# EAGLE schematic SDA391V1_TASLAK (EAGLE 9.6.2)
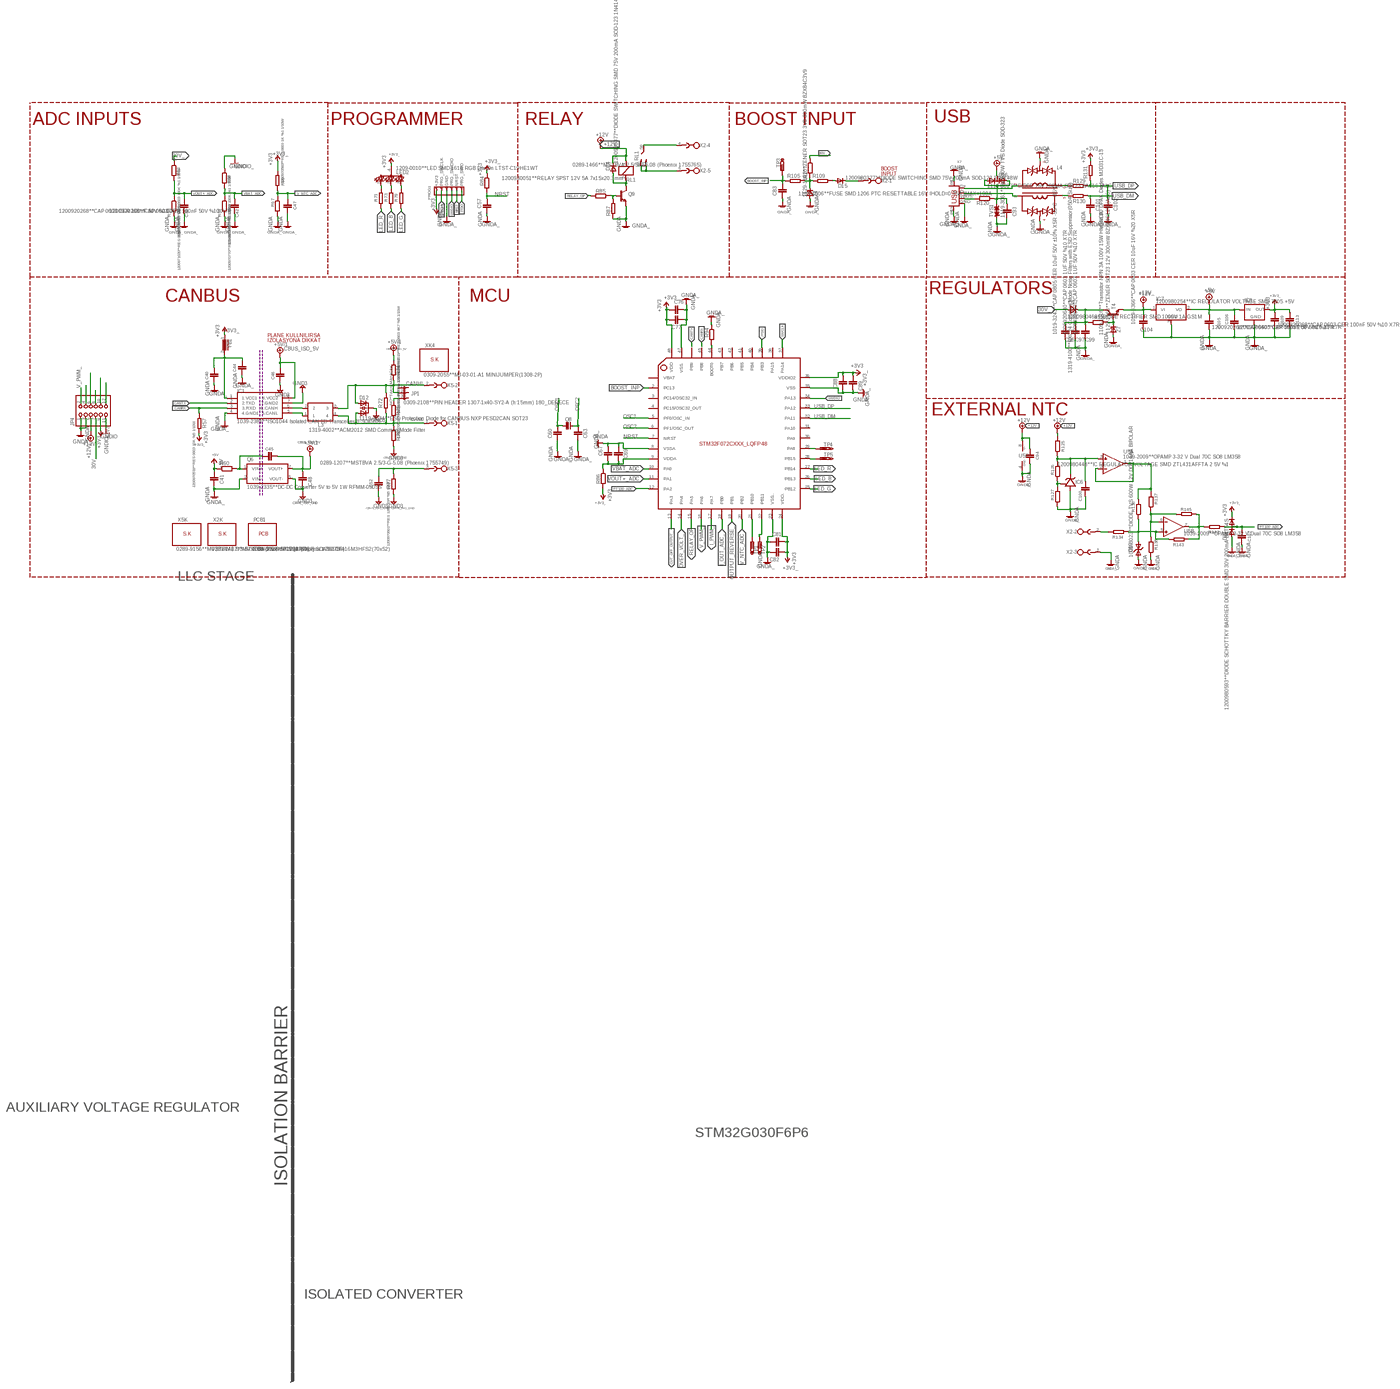
[diagram p0: schematic, sheet 1, overview]
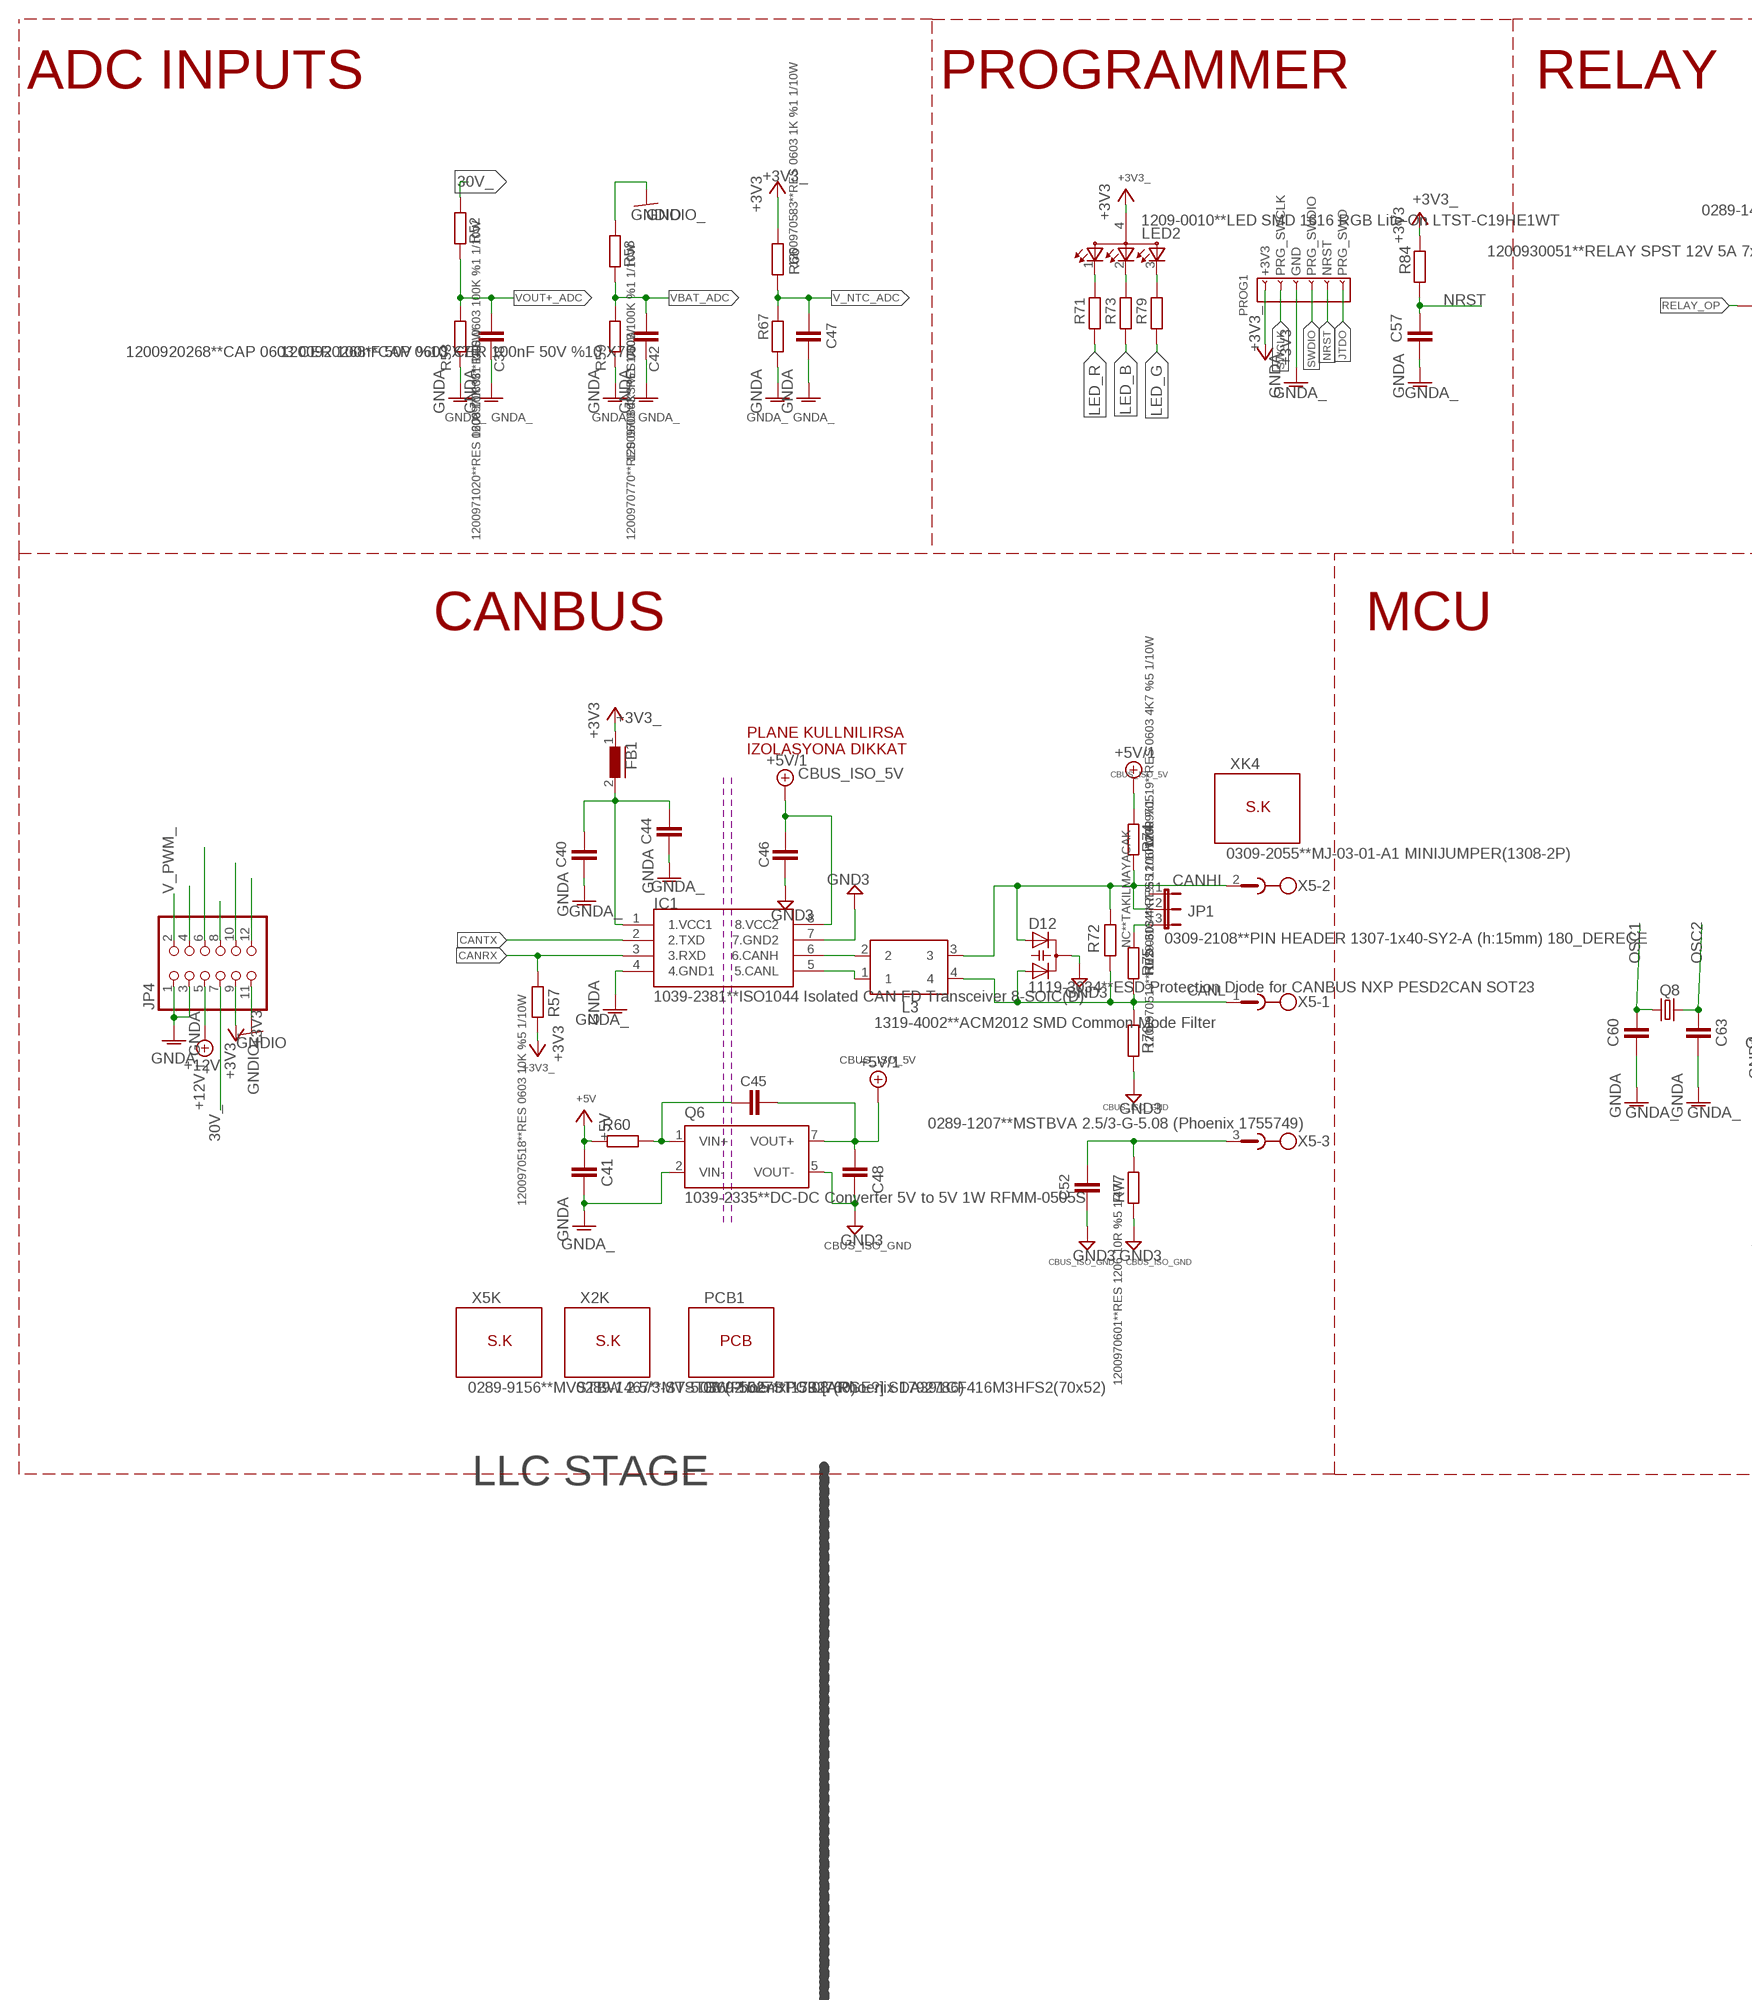
[diagram p1: schematic, sheet 1, part 1 of 4]
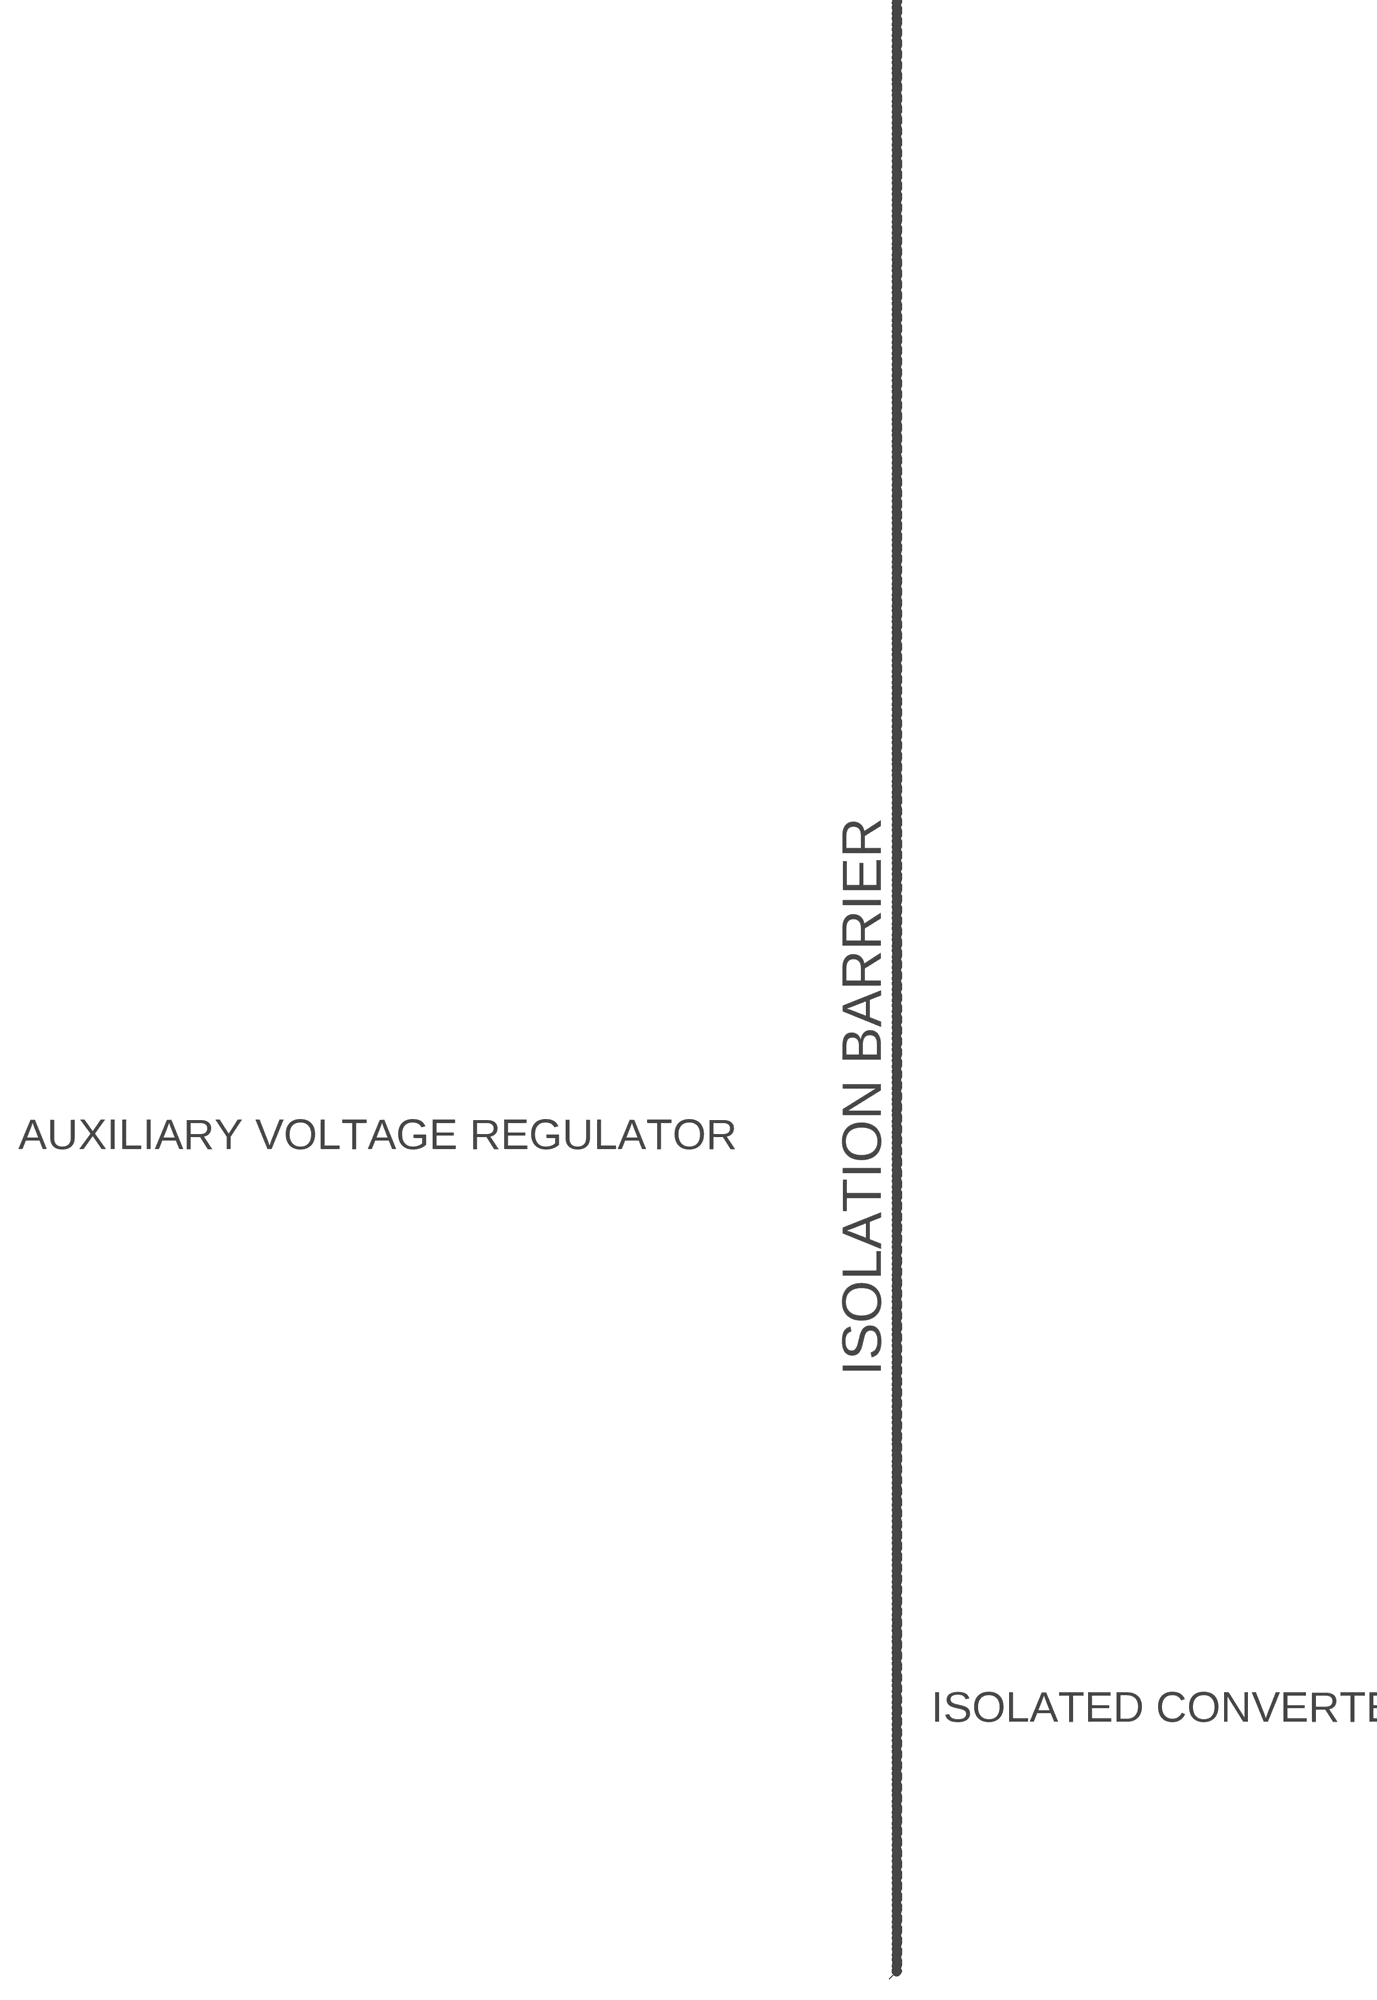
[diagram p2: schematic, sheet 1, part 2 of 4]
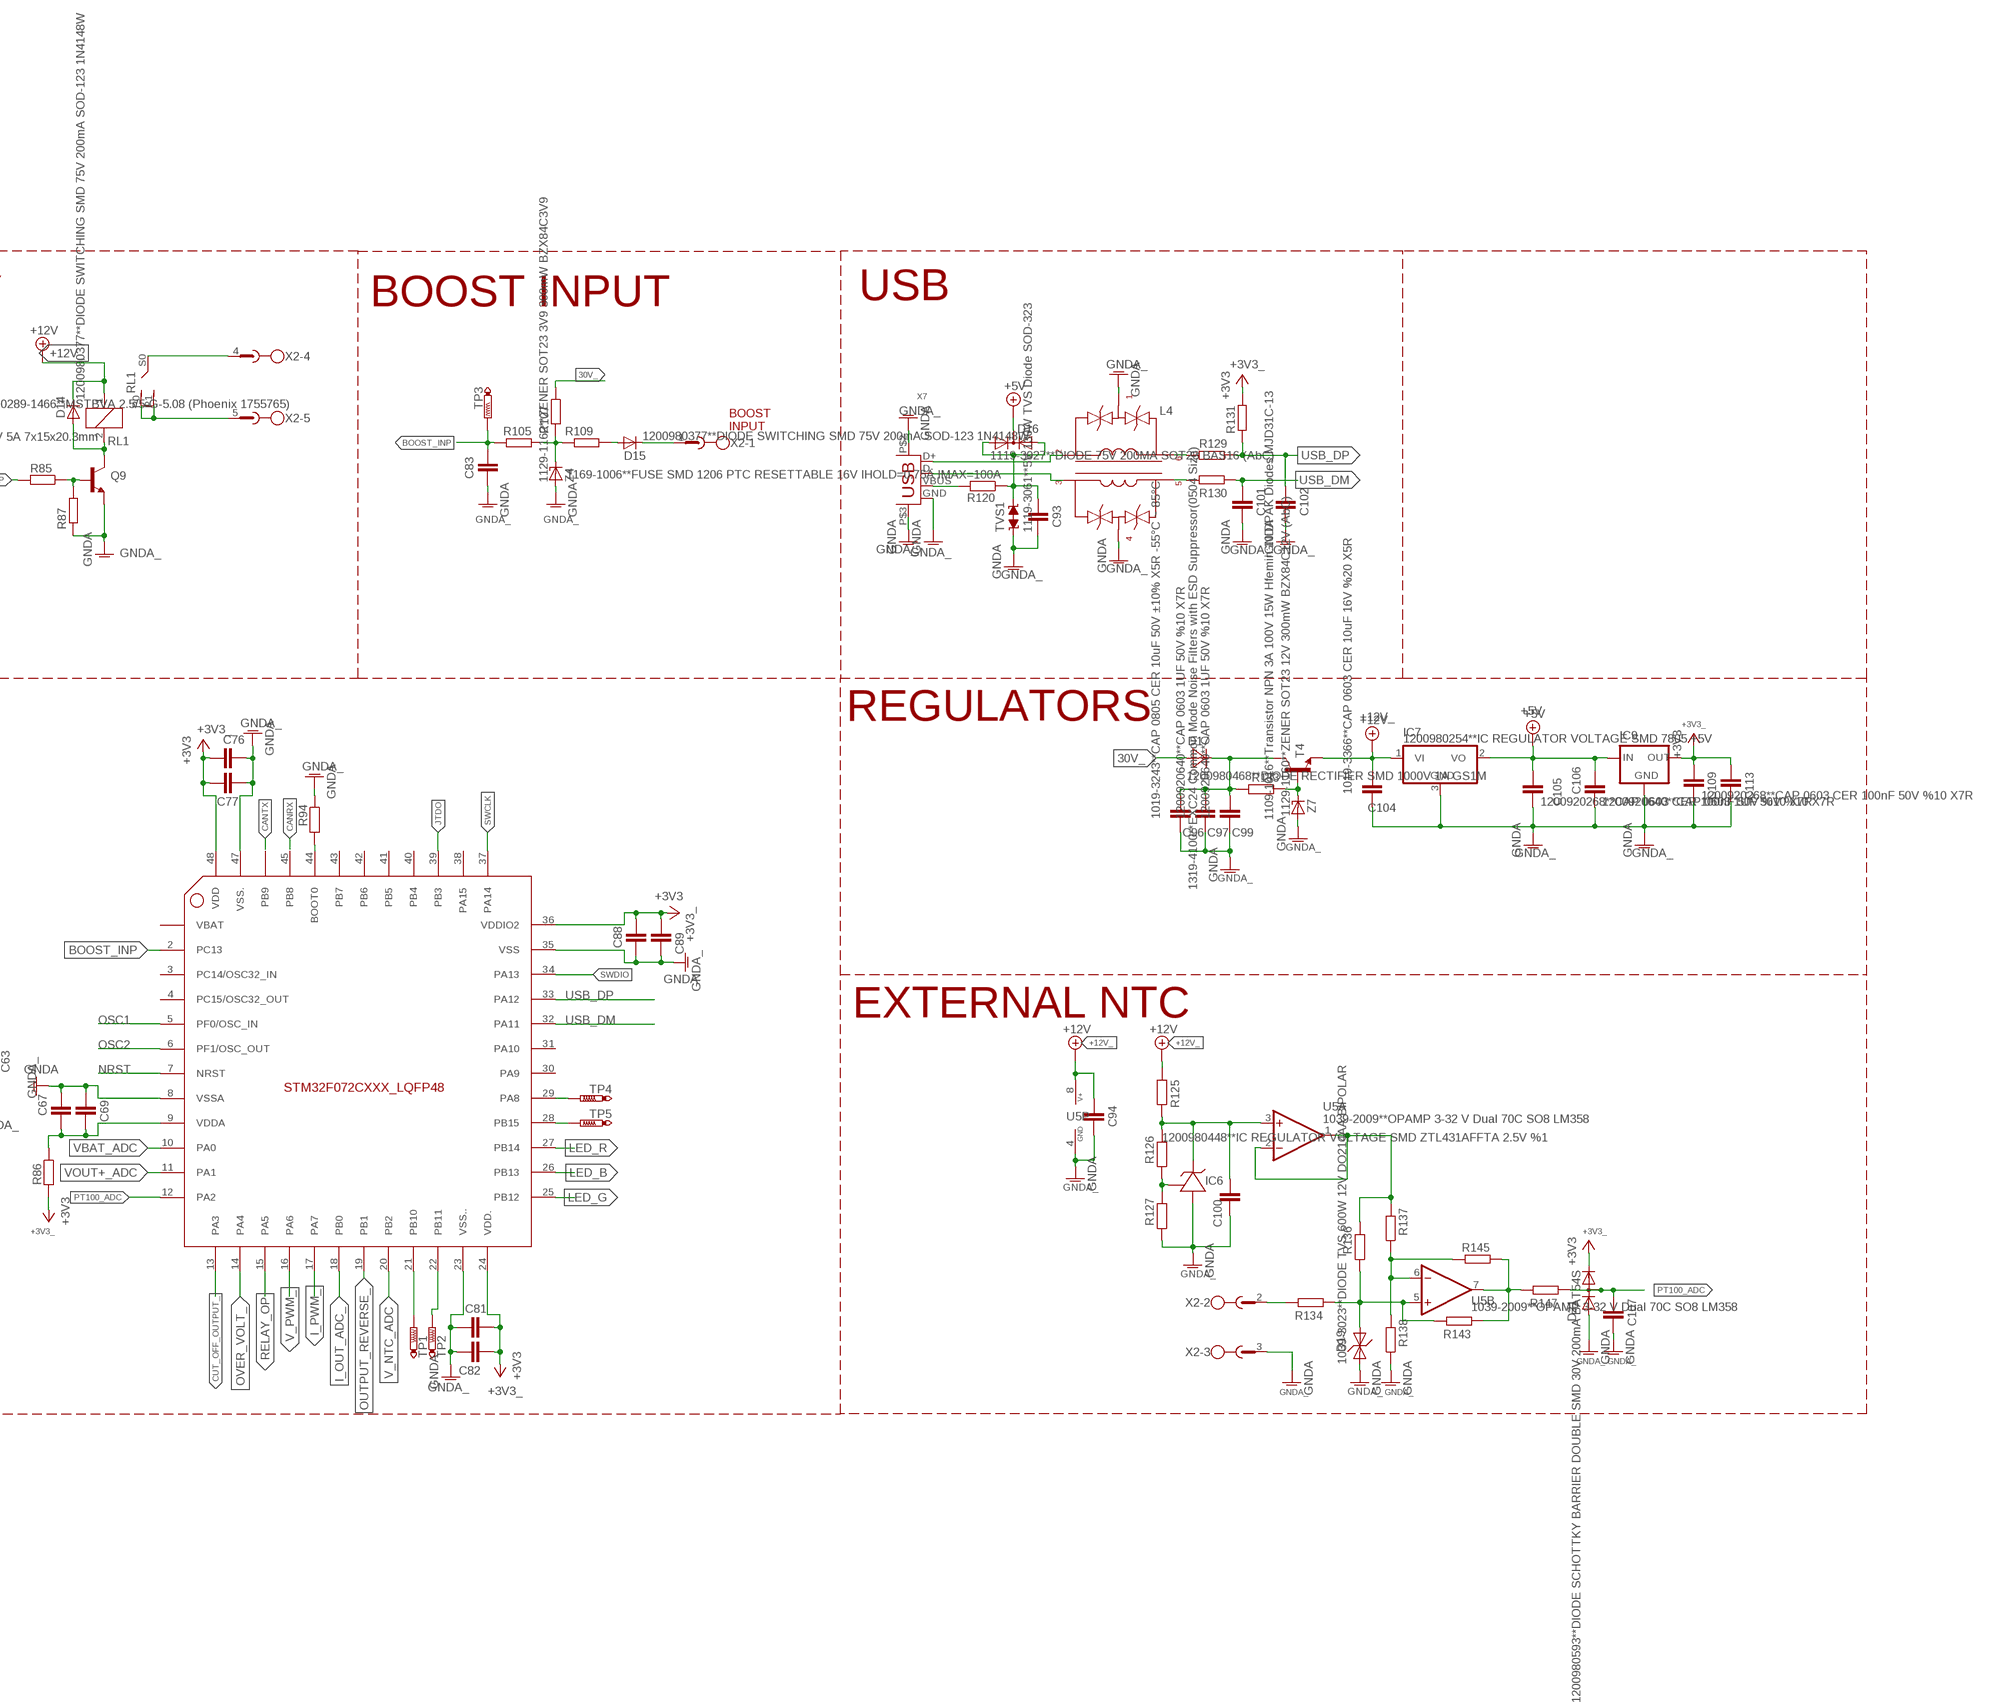
[diagram p3: schematic, sheet 1, part 3 of 4]
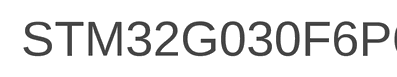
[diagram p4: schematic, sheet 1, part 4 of 4]

## Parts
C38  1200920268**CAP 0603 CER 100nF 50V %10 X7R  C-EUC0603E  [C0603_ENKO]
C40  1200920253**CAP 0603 CER 10n 50V%10 X7R  C-EUC0603E  [C0603_ENKO]
C41  1019-3362**CAP 0603 CER 2.2uF 10V %10 X5R  C-EUC0603E  [C0603_ENKO]
C42  1200920268**CAP 0603 CER 100nF 50V %10 X7R  C-EUC0603E  [C0603_ENKO]
C44  1200920268**CAP 0603 CER 100nF 50V %10 X7R  C-EUC0603E  [C0603_ENKO]
C45  0019-3020**CAP TH CER 470pF 3kV Y5P %10 85C F=7.5 D=8.5  C050-055X075_SMALL  [C050-055X075_SMALL]
C46  1200920268**CAP 0603 CER 100nF 50V %10 X7R  C-EUC0603E  [C0603_ENKO]
C47  1200920268**CAP 0603 CER 100nF 50V %10 X7R  C-EUC0603E  [C0603_ENKO]
C48  1019-3362**CAP 0603 CER 2.2uF 10V %10 X5R  C-EUC0603E  [C0603_ENKO]
C52  1200920253**CAP 0603 CER 10n 50V%10 X7R  C-EUC0603E  [C0603_ENKO]
C57  1200920268**CAP 0603 CER 100nF 50V %10 X7R  C-EUC0603E  [C0603_ENKO]
C60  1019-3352**CAP 0603 CER 22pF 50V %5 NPO  C-EUC0603E  [C0603_ENKO]
C63  1019-3352**CAP 0603 CER 22pF 50V %5 NPO  C-EUC0603E  [C0603_ENKO]
C67  1200920268**CAP 0603 CER 100nF 50V %10 X7R  C-EUC0603E  [C0603_ENKO]
C69  1019-3167**CAP 0603 CER 10nF 50V %10 X7R (AbC)  C-EUC0603E  [C0603_ENKO]
C76  1200920268**CAP 0603 CER 100nF 50V %10 X7R  C-EUC0603E  [C0603_ENKO]
C77  1019-3167**CAP 0603 CER 10nF 50V %10 X7R (AbC)  C-EUC0603E  [C0603_ENKO]
C81  1019-3167**CAP 0603 CER 10nF 50V %10 X7R (AbC)  C-EUC0603E  [C0603_ENKO]
C82  1200920268**CAP 0603 CER 100nF 50V %10 X7R  C-EUC0603E  [C0603_ENKO]
C83  1019-3167**CAP 0603 CER 10nF 50V %10 X7R (AbC)  C-EUC0603E  [C0603_ENKO]
C88  1019-3167**CAP 0603 CER 10nF 50V %10 X7R (AbC)  C-EUC0603E  [C0603_ENKO]
C89  1200920268**CAP 0603 CER 100nF 50V %10 X7R  C-EUC0603E  [C0603_ENKO]
C93  1200920268**CAP 0603 CER 100nF 50V %10 X7R  C-EUC0603E  [C0603_ENKO]
C94  1200920268**CAP 0603 CER 100nF 50V %10 X7R  C-EUC0603E  [C0603_ENKO]
C96  1019-3243**CAP 0805 CER 10uF 50V ±10% X5R -55°C ~ 85°C  C-EUC0805E  [C0805_ENKO]
C97  1200920640**CAP 0603 1UF 50V %10 X7R  C-EUC0603E  [C0603_ENKO]
C99  1200920640**CAP 0603 1UF 50V %10 X7R  C-EUC0603E  [C0603_ENKO]
C100  1200920268**CAP 0603 CER 100nF 50V %10 X7R  C-EUC0603E  [C0603_ENKO]
C101  1019-3381**CAP 0603 CER 33pf 50V %5 NPO(COG)  C-EUC0603E  [C0603_ENKO]
C102  1019-3381**CAP 0603 CER 33pf 50V %5 NPO(COG)  C-EUC0603E  [C0603_ENKO]
C104  1019-3366**CAP 0603 CER 10uF 16V %20 X5R  C-EUC0603E  [C0603_ENKO]
C105  1200920268**CAP 0603 CER 100nF 50V %10 X7R  C-EUC0603E  [C0603_ENKO]
C106  1200920640**CAP 0603 1UF 50V %10 X7R  C-EUC0603E  [C0603_ENKO]
C107  1200920268**CAP 0603 CER 100nF 50V %10 X7R  C-EUC0603E  [C0603_ENKO]
C109  1200920268**CAP 0603 CER 100nF 50V %10 X7R  C-EUC0603E  [C0603_ENKO]
C113  1019-3366**CAP 0603 CER 10uF 16V %20 X5R  C-EUC0603E  [C0603_ENKO]
D12  1119-3034**ESD Protection Diode for CANBUS NXP PESD2CAN SOT23  DIODE-2CAPACITANCESOT23  [SOT23]
D14  1200980377**DIODE SWITCHING SMD 75V 200mA SOD-123 1N4148W  DIODE-SOD123  [SOD123]
D15  1200980377**DIODE SWITCHING SMD 75V 200mA SOD-123 1N4148W  DIODE-SOD123  [SOD123]
D16  1119-3027**DIODE 75V 200MA SOT23 BAS16 (AbC)  DIODE-2AC|CASOT23  [SOT23]
D17  1200980468**DIODE RECTIFIER SMD 1000V 1A GS1M  M7_DC_DIYOT  [M7_DC_DIYOT]
D19  1039-3023**DIODE TVS 600W 12V DO214AA BIPOLAR  TRANSIL_SMB  [TRANSIL_SMB]
D21  1200980593**DIODE SCHOTTKY BARRIER DOUBLE SMD 30V 200mA BAT54S  BAV199  [SOT23]
FB1  1319-4060**Ferrite Bead SMD 0805 2kOhm@100MHz 300mA LAIRD HZ0805C202R-10  FERRITE_BEAT_0805  [FERRITE_BEAT_0805]
IC1  1039-2381**ISO1044 Isolated CAN FD Transceiver 8-SOIC(D)  ISO1044  [ISO1044]
IC6  1200980448**IC REGULATOR VOLTAGE SMD ZTL431AFFTA 2.5V %1  TL431_SOT23F  [TL431_SOT23F]
IC7  1200980254**IC REGULATOR VOLTAGE SMD 7805 +5V  7806DT  [TO252]
IC9  1039-3003**Voltage Regulator SOT-89 3.3V Diodes AP2204RA-3.3TRG1  S-812XSGUP  [SOT89]
JP1  0309-2108**PIN HEADER 1307-1x40-SY2-A (h:15mm) 180_DERECE  JP2E  [JP2]
JP4  PINHD-2X6_2.54  [2X06]
L3  1319-4002**ACM2012 SMD Common Mode Filter  ACM2012-900--2P-T002  [ACM2012-900--2P-T002]
L4  1319-4100**EXC24 Common Mode Noise Filters with ESD Suppressor(0504 Size)  EXC24CS_COMMON_MODE  [EXC24CS_COMMON_MODE]
LED2  1209-0010**LED SMD 1616 RGB Lite-On LTST-C19HE1WT  CCS3210_RGB_LED  [CCS3210_RGB_LED]
PCB1  0369-5027**PCB [ARGE?] SDA391CF416M3HFS2(70x52)  PCB  [PCB]
PROG1  NC**TAKILMAYACAK  PROG_6PIN  [PROG_6PIN]
Q6  1039-2335**DC-DC Converter 5V to 5V 1W RFMM-0505S  RFMM-0505S  [RFMM-0505S]
Q8  1149-0006**HC49S SMD KRISTAL 8MHZ -40+85 20PF 50PPM FAT Y3MM  CRYSTALHC49UP  [HC49UP]
Q9  1200980090**TRANS SMD NPN BC847B SOT-23  BC846ALT1SMD  [SOT23]
R52  1200970803**RES 0603 100K %1 1/10W  R-EU_R0603E  [R0603_ENKO]
R53  1200971020**RES 0603 10K %1 1/10W  R-EU_R0603E  [R0603_ENKO]
R57  1200970518**RES 0603 10K %5 1/10W  R-EU_R0603E  [R0603_ENKO]
R58  1200970803**RES 0603 100K %1 1/10W  R-EU_R0603E  [R0603_ENKO]
R59  1200970770**RES 0603 4K3 %1 1/10W  R-EU_R0603E  [R0603_ENKO]
R60  1319-4025**INDUCTOR SMD 0805 4.7uH 500mA CL2012C-4R7M Core Master  R-EU_R0805E  [R0805_ENKO]
R66  1200970583**RES 0603 1K %1 1/10W  R-EU_R0603E  [R0603_ENKO]
R67  1169-1001**TSM2A103F3951RZ THINKING 0805 10K NTC 125C  R-EU_R0805E  [R0805_ENKO]
R71  1029-2005**RES 0603 220R %1  R-EU_R0603E  [R0603_ENKO]
R72  NC**TAKILMAYACAK  R-EU_R1206E  [R1206_ENKO]
R73  1029-2005**RES 0603 220R %1  R-EU_R0603E  [R0603_ENKO]
R74  1200970519**RES 0603 4K7 %5 1/10W  R-EU_R0603E  [R0603_ENKO]
R75  1029-3164**RES 1206 120R %1  R-EU_R1206E  [R1206_ENKO]
R76  1200970519**RES 0603 4K7 %5 1/10W  R-EU_R0603E  [R0603_ENKO]
R77  1200970601**RES 1206 10R %5 1/4W  R-EU_R1206E  [R1206_ENKO]
R79  1029-2005**RES 0603 220R %1  R-EU_R0603E  [R0603_ENKO]
R84  1200970518**RES 0603 10K %5 1/10W  R-EU_R0603E  [R0603_ENKO]
R85  1200970522**RES 0603 1K %5 1/10W  R-EU_R0603E  [R0603_ENKO]
R86  1319-4060**Ferrite Bead SMD 0805 2kOhm@100MHz 300mA LAIRD HZ0805C202R-10  R-EU_R0805E  [R0805_ENKO]
R87  1200970518**RES 0603 10K %5 1/10W  R-EU_R0603E  [R0603_ENKO]
R94  1200970522**RES 0603 1K %5 1/10W  R-EU_R0603E  [R0603_ENKO]
R105  1200970518**RES 0603 10K %5 1/10W  R-EU_R0603E  [R0603_ENKO]
R107  1200970568**RES 0603 47K %5 1/10W  R-EU_R0603E  [R0603_ENKO]
R109  1409-0025**RES 0603 470R %5 1/16W  R-EU_R0603E  [R0603_ENKO]
R120  1169-1006**FUSE SMD 1206 PTC RESETTABLE 16V IHOLD=0.75A IMAX=100A  R-EU_R1206E  [R1206_ENKO]
R125  1029-2234**RES 0603 4K7 %1  R-EU_R0603E  [R0603_ENKO]
R126  1200970583**RES 0603 1K %1 1/10W  R-EU_R0603E  [R0603_ENKO]
R127  1029-2231**RES 0603 1K8 %1  R-EU_R0603E  [R0603_ENKO]
R129  1029-6086**RES 0603 22R %1  R-EU_R0603E  [R0603_ENKO]
R130  1029-6086**RES 0603 22R %1  R-EU_R0603E  [R0603_ENKO]
R131  1200970852**RES 0603 1K5 %5 1/10W  R-EU_R0603E  [R0603_ENKO]
R133  1200970121**RES 0805 1K %5 1/8W  R-EU_R0805E  [R0805_ENKO]
R134  1029-6086**RES 0603 22R %1  R-EU_R0603E  [R0603_ENKO]
R136  1029-2234**RES 0603 4K7 %1  R-EU_R0603E  [R0603_ENKO]
R137  1200970684**RES 0603 47K %1 1/10W  R-EU_R0603E  [R0603_ENKO]
R138  1200970583**RES 0603 1K %1 1/10W  R-EU_R0603E  [R0603_ENKO]
R143  1029-2229**RES 0603 120K %1  R-EU_R0603E  [R0603_ENKO]
R145  1029-2219**RES 0603 30K %1  R-EU_R0603E  [R0603_ENKO]
R147  1200970730**RES 0603 560R %1 1/10W  R-EU_R0603E  [R0603_ENKO]
RL1  1200930051**RELAY SPST 12V 5A 7x15x20.3mm  ALD1_AND_ALJ_RELAY  [ALD1_AND_ALJ_RELAY]
T4  1109-1016**Transistor NPN 3A 100V 15W Hfemin:10 DPAK Diodes MJD31C-13  MJD31  [DPAK]
TP1  PTR1TP20R  [TP20R]
TP2  PTR1TP20R  [TP20R]
TP3  PTR1TP20R  [TP20R]
TP4  PTR1TP20R  [TP20R]
TP5  PTR1TP20R  [TP20R]
TVS1  1119-3061**5V 130W TVS Diode SOD-323  TVS-BD-SOD323  [SOD323]
U4  1039-2220**STM32F072C8T6 64K Flash USB, CAN  STM32F072CXXX_LQFP48  [STM32F072CXXX_LQFP48]
U5  1039-2009**OPAMP 3-32 V Dual 70C SO8 LM358  LM358D  [SO08]
X2  0289-1466**MSTBVA 2.5/5-G-5.08 (Phoenix 1755765)  MSTBV5  [MSTBV5]
X2K  0289-1467**MVSTBW 2.5/5-ST-5.08 (Phoenix 1792786)  SOKET  [SOKET]
X5  0289-1207**MSTBVA 2.5/3-G-5.08 (Phoenix 1755749)  MSTBV3  [MSTBV3]
X5K  0289-9156**MVSTBW 2.5/3-ST-5.08 (Phoenix 1792760)  SOKET  [SOKET]
X7  0309-1065**USB Type-B Mini Connector Vertical  USB-BV  [USB-BV]
XK4  0309-2055**MJ-03-01-A1 MINIJUMPER(1308-2P)  SOKET  [SOKET]
Z4  1129-1162**ZENER SOT23 3V9 300mW BZX84C3V9  ZENER-DIODESOT23  [SOT23]
Z7  1129-1160**ZENER SOT23 12V 300mW BZX84C12V (AbC)  ZENER-DIODESOT23  [SOT23]

## Nets
5.CANL: IC1.5(5.CANL) L3.1
30V_: D17.A JP4.7 R52.1 R107.1
+3V3_: C76.1 C77.1 C81.1 C82.1 C88.1 C89.1 C109.1 C113.1 D21.2(C) FB1.1 IC9.3(OUT) JP4.9 LED2.4 PROG1.1(+3V3) R57.2 R66.2 R84.1 R86.2 R131.2 U4.24(VDD.) U4.36(VDDIO2) U4.48(VDD) ; supply symbol labelled +3V3
+5V: C41.1 C105.1 C106.1 D16.3(C) IC7.2(VO) IC9.2(IN) R60.1
+12V_: C94.1 C104.1 D14.C IC7.1(VI) JP4.5 R125.2 RL1.1 T4.3(E) U5.8(P:V+) ; supply symbol labelled +12V
BOOST_INP: C83.1 R105.1 TP3.TP U4.2(PC13)
CANHI: D12.1(A1) JP1.2 L3.3 R72.2 R74.1 X5.2
CANL: D12.2(A2) L3.4 R72.1 R75.1 R76.2 X5.1
CANRX: IC1.3(3.RXD) R57.1 U4.45(PB8)
CANTX: IC1.2(2.TXD) U4.46(PB9)
CBUS_ISO_5V: C45.2 C46.2 C48.1 IC1.8(8.VCC2) Q6.7(VOUT+) R74.2 ; supply symbol labelled +5V/1
CBUS_ISO_GND: C48.2 C52.2 IC1.7(7.GND2) Q6.5(VOUT-) R76.1 R77.2 ; supply symbol labelled GND3
CUT_OFF_OUTPUT_: JP4.6 U4.13(PA3)
GND3: C46.1 D12.3(C)
GNDA_: C38.2 C40.1 C41.2 C42.2 C44.1 C47.2 C57.1 C60.2 C63.2 C67.2 C69.2 C76.2 C77.2 C81.2 C82.2 C83.2 C88.2 C89.2 C93.2 C94.2 C96.2 C97.2 C99.2 C100.1 C101.2 C102.2 C104.2 C105.2 C106.2 C107.1 C109.2 C113.2 D19.A1 D21.1(A) IC1.4(4.GND1) IC6.A IC7.3(GND) IC9.1(GND) JP4.1 JP4.3 L4.1(1.GND) L4.4(4.GND) PROG1.3(GND) Q6.2(VIN-) Q9.2(E) R53.2 R59.2 R67.2 R87.1 R94.1 R127.1 R138.1 TVS1.A U4.8(VSSA) U4.23(VSS..) U4.35(VSS) U4.47(VSS.) U5.4(P:GND) X2.3 X7.GND X7.P$2 X7.P$3 Z4.1(A) Z7.1(A) ; supply symbol labelled GNDA
GNDIO_: JP4.11 R58.1 ; supply symbol labelled GNDIO
I_OUT_ADC_: JP4.10 U4.18(PB0)
I_PWM_: JP4.4 U4.17(PA7)
JTDO: PROG1.6(PRG_SWO) U4.39(PB3)
LED_B: R73.1 U4.26(PB13)
LED_G: R79.1 U4.25(PB12)
LED_R: R71.1 U4.27(PB14)
N$1: L4.6 R129.1
N$7: LED2.1 R71.2
N$10: R105.2 R107.2 R109.2 Z4.3(C)
N$14: D15.A R109.1
N$33: D15.C X2.1
N$42: IC6.R R126.1 R127.2
N$44: R134.1 X2.2
N$66: TP1.TP U4.21(PB10)
N$67: R94.2 U4.44(BOOT0)
N$79: TP2.TP U4.22(PB11)
N$81: TP5.TP U4.28(PB15)
N$86: TP4.TP U4.29(PA8)
N$87: C52.1 R77.1 X5.3
N$89: JP1.3 R75.2
N$90: IC1.6(6.CANH) L3.2
N$91: C45.1 Q6.1(VIN+) R60.2
N$92: C67.1 C69.1 R86.1 U4.9(VDDA)
N$95: LED2.2 R73.2
N$96: LED2.3 R79.2
N$101: R137.1 R138.2 R145.1 U5.6(B:-IN)
N$102: D19.A R134.2 R136.1 R143.1 U5.5(B:+IN)
N$104: R143.2 R145.2 R147.1 U5.7(B:OUT)
N$107: D14.A Q9.3(C) RL1.2
N$108: Q9.1(B) R85.1 R87.2
N$109: L4.5 R130.1
N$110: C100.2 IC6.C R125.1 R126.2 U5.3(A:+IN)
N$111: R136.2 R137.2 U5.1(A:OUT) U5.2(A:-IN)
N$113: R133.1 T4.1(B) Z7.3(C)
N$114: C96.1 C97.1 C99.1 D17.C R133.2 T4.4(C)
N$156: L4.3 X7.D-
N$157: L4.2 X7.D+
N$161: C93.1 D16.1(A1) D16.2(A2) R120.1 TVS1.C
N$210: C40.2 C44.2 FB1.2 IC1.1(1.VCC1)
NRST: C57.2 PROG1.5(NRST) R84.2 U4.7(NRST)
OSC1: C60.1 Q8.1 U4.5(PF0/OSC_IN)
OSC2: C63.1 Q8.2 U4.6(PF1/OSC_OUT)
OUTPUT_REVERSE_: JP4.12 U4.19(PB1)
OVER_VOLT_: JP4.8 U4.14(PA4)
PT100_ADC: C107.2 D21.3(AC) R147.2 U4.12(PA2)
RELAY_OP: R85.2 U4.15(PA5)
RL+: RL1.P0 RL1.P1 X2.5
RL-: RL1.S0 X2.4
SWCLK: PROG1.2(PRG_SWCLK) U4.37(PA14)
SWDIO: PROG1.4(PRG_SWDIO) U4.34(PA13)
USB_DM: C101.1 R130.2 U4.32(PA11)
USB_DP: C102.1 R129.2 R131.1 U4.33(PA12)
V_NTC_ADC: C47.1 R66.1 R67.1 U4.20(PB2)
V_PWM_: JP4.2 U4.16(PA6)
VBAT_ADC: C42.1 R58.2 R59.1 U4.10(PA0)
VBUS1: R120.2 X7.VBUS
VOUT+_ADC: C38.1 R52.2 R53.1 U4.11(PA1)
Unconnected: JP1.1 U4.1(VBAT) U4.3(PC14/OSC32_IN) U4.4(PC15/OSC32_OUT) U4.30(PA9) U4.31(PA10) U4.38(PA15) U4.40(PB4) U4.41(PB5) U4.42(PB6) U4.43(PB7)

## Notes on the sheet
- ADC INPUTS | PROGRAMMER | RELAY | BOOST INPUT | USB
- BOOST 
  INPUT
- MICROCONTROLLER
- USB
- REGULATORS
- CANBUS | MCU
- PLANE KULLNILIRSA 
  IZOLASYONA DIKKAT
- EXTERNAL NTC
- LLC STAGE
- AUXILIARY VOLTAGE REGULATOR
- STM32G030F6P6
- ISOLATION BARRIER
- ISOLATED CONVERTER

## Library data of the parts
C38 C40-C42 C44 C46-C48 C52 C57 C60 C63 C67 C69 C76 C77 C81-C83 C88 C89 C93 C94 C96 C97 C99-C102 C104-C107 C109 C113 = rcl:C-EU: CAPACITOR, European symbol
C45 = ENKO2:C050-055X075_SMALL
D12 = diode:DIODE-2CAPACITANCE: Capacity DIODE variable-capacitance diode (Infineon)
D14 D15 = diode:DIODE-: DIODE
D16 = diode:DIODE-2AC|CA: Dual DIODE Anode-Cathode|Cathode-Anode
D17 = enko:M7_DC_DIYOT
D19 = diode:TRANSIL_SMB
D21 = diode:BAV199: DIODE low-leakage double diode
FB1 = ENKO2:FERRITE_BEAT_0805
IC1 = enko:ISO1044
IC6 = enko:TL431_SOT23F
IC7 = linear:78*: Positive VOLTAGE REGULATOR Source: http://cache.national.com/ds/LM/LM78L05.pdf http://www.fairchildsemi.com/ds/LM/LM7805.pdf
IC9 = v-reg-3:S-812XSG: Low power, low dropout positive regulator
JP1 = jumper:JP2E: JUMPER
JP4 = pinhead-fixdrills:PINHD-2X6: PIN HEADER
L3 = enko:ACM2012-900--2P-T002
L4 = enko:EXC24CS_COMMON_MODE
LED2 = enko:CCS3210_RGB_LED
PCB1 = BOM:PCB
PROG1 = ENKO2:PROG_6PIN
Q6 = enko:RFMM-0505S
Q8 = crystal:CRYSTAL: CRYSTAL; OC_FARNELL: unknown; OC_NEWARK: unknown
Q9 = transistor-npn:BC846*: NPN Transistor
R52 R53 R57-R60 R66 R67 R71-R77 R79 R84-R87 R94 R105 R107 R109 R120 R125-R127 R129-R131 R133 R134 R136-R138 R143 R145 R147 = rcl:R-EU_: RESISTOR, European symbol
RL1 = enko:ALD1_AND_ALJ_RELAY
T4 = transistor:MJD31*: Complementary Power Transistors
TP1-TP5 = testpad:PTR1: TEST PIN
TVS1 = supressor:TVS-BD-: TVS BI-DIRECTIONAL
U4 = enko:STM32F072CXXX_LQFP48
U5 = op-amp:LM358: OP-AMP - Dual
X2 = con-phoenix-508:MSTBV5: PHOENIX; MPN: MSTBV 2,5/5-GF-5.08; OC_FARNELL: 1792795; OC_NEWARK: 69R9848
X2K X5K XK4 = BOM:SOKET
X5 = con-phoenix-508:MSTBV3: PHOENIX; MPN: MSTBV 2,5/3-GF-5.08; OC_FARNELL: 1792793; OC_NEWARK: 69R9846
X7 = enko:USB-BV
Z4 Z7 = diode:ZENER-DIODE: Z-Diode